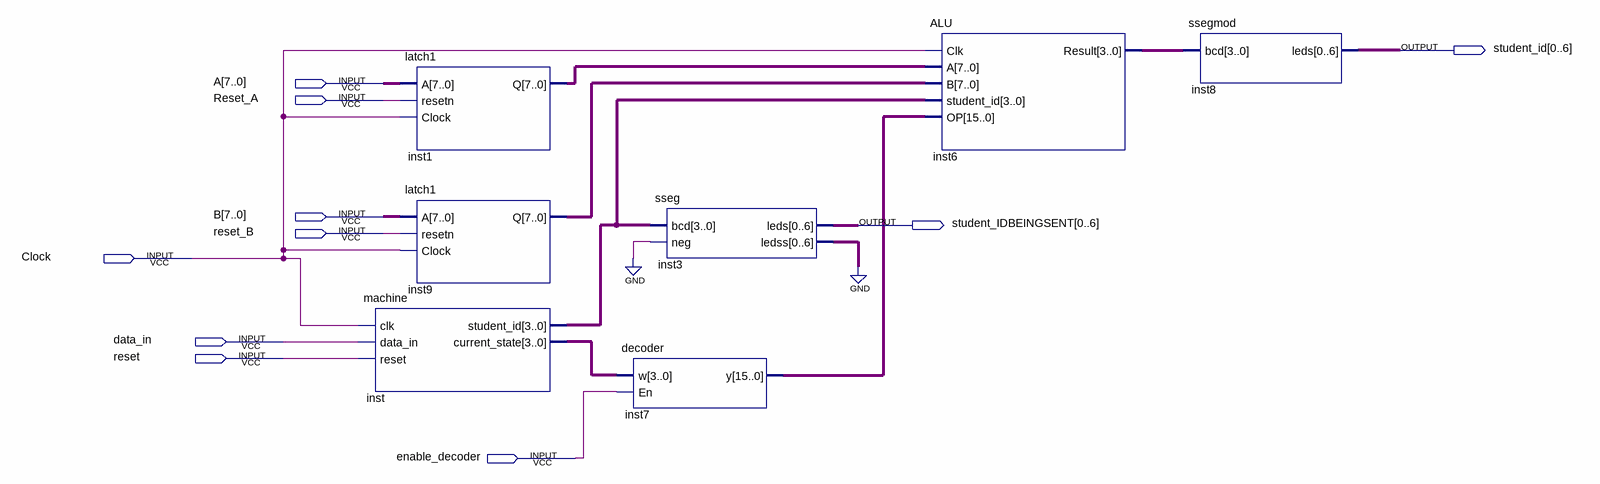
[diagram p0: schematic sheet]
// Quartus schematic 2ndcircuit.bdf as structural Verilog: 7 symbols, 10 pins
module \2ndcircuit  (
  input  [7:0] A,
  input  Reset_A,
  input  [7:0] B,
  input  reset_B,
  input  Clock,
  input  data_in,
  input  reset,
  input  enable_decoder,
  output [0:6] student_id,
  output [0:6] student_IDBEINGSENT
);

  wire [3:0] inst6_result, inst_current_state, inst_student_id;
  wire [6:0] inst3_ledss;
  wire [7:0] inst1_q, inst9_q;
  wire [15:0] inst7_y;

  machine inst (
    .clk(Clock), .data_in(data_in), .reset(reset), .student_id(inst_student_id),
    .current_state(inst_current_state));
  latch1 inst1 (.A(A), .resetn(Reset_A), .Clock(Clock), .Q(inst1_q));
  latch1 inst9 (.A(B), .resetn(reset_B), .Clock(Clock), .Q(inst9_q));
  sseg inst3 (.bcd(inst_student_id), .neg(1'b0), .leds(student_IDBEINGSENT), .ledss(inst3_ledss));
  decoder inst7 (.w(inst_current_state), .En(enable_decoder), .y(inst7_y));
  ALU inst6 (.Clk(Clock), .A(inst1_q), .B(inst9_q), .student_id(inst_student_id), .OP(inst7_y), .Result(inst6_result));
  ssegmod inst8 (.bcd(inst6_result), .leds(student_id));
  // also tied to GND on the sheet: {inst3_ledss[0], inst3_ledss[1], inst3_ledss[2], inst3_ledss[3], inst3_ledss[4], inst3_ledss[5], inst3_ledss[6]}
endmodule
